# Altium schematic sheet DBL TLC5940 driver for High load.SchDoc: DBL TLC5940 driver for High load
size A4; Revision: 0; SheetNumber: 1; SheetTotal: 2; Version: 1.0; Variant: Variant; Modification: Mod; Project: Light Control; PageSetup: Record=PageOptions|CenterHorizontal=True|CenterVertical=True|PrintScale=0.97|XCorrection=1.00|YCorrection=1.00|PrintKind=1|BorderSize=5000000|LeftOffset=0|BottomOffset=0|Orientation=2|PaperLength=2970|PaperWidth=2100|Scale=100|PaperSource=7|PrintQuality=-4|MediaType=1|DitherType=10|PaperKind=A4|PrintScaleMode=1
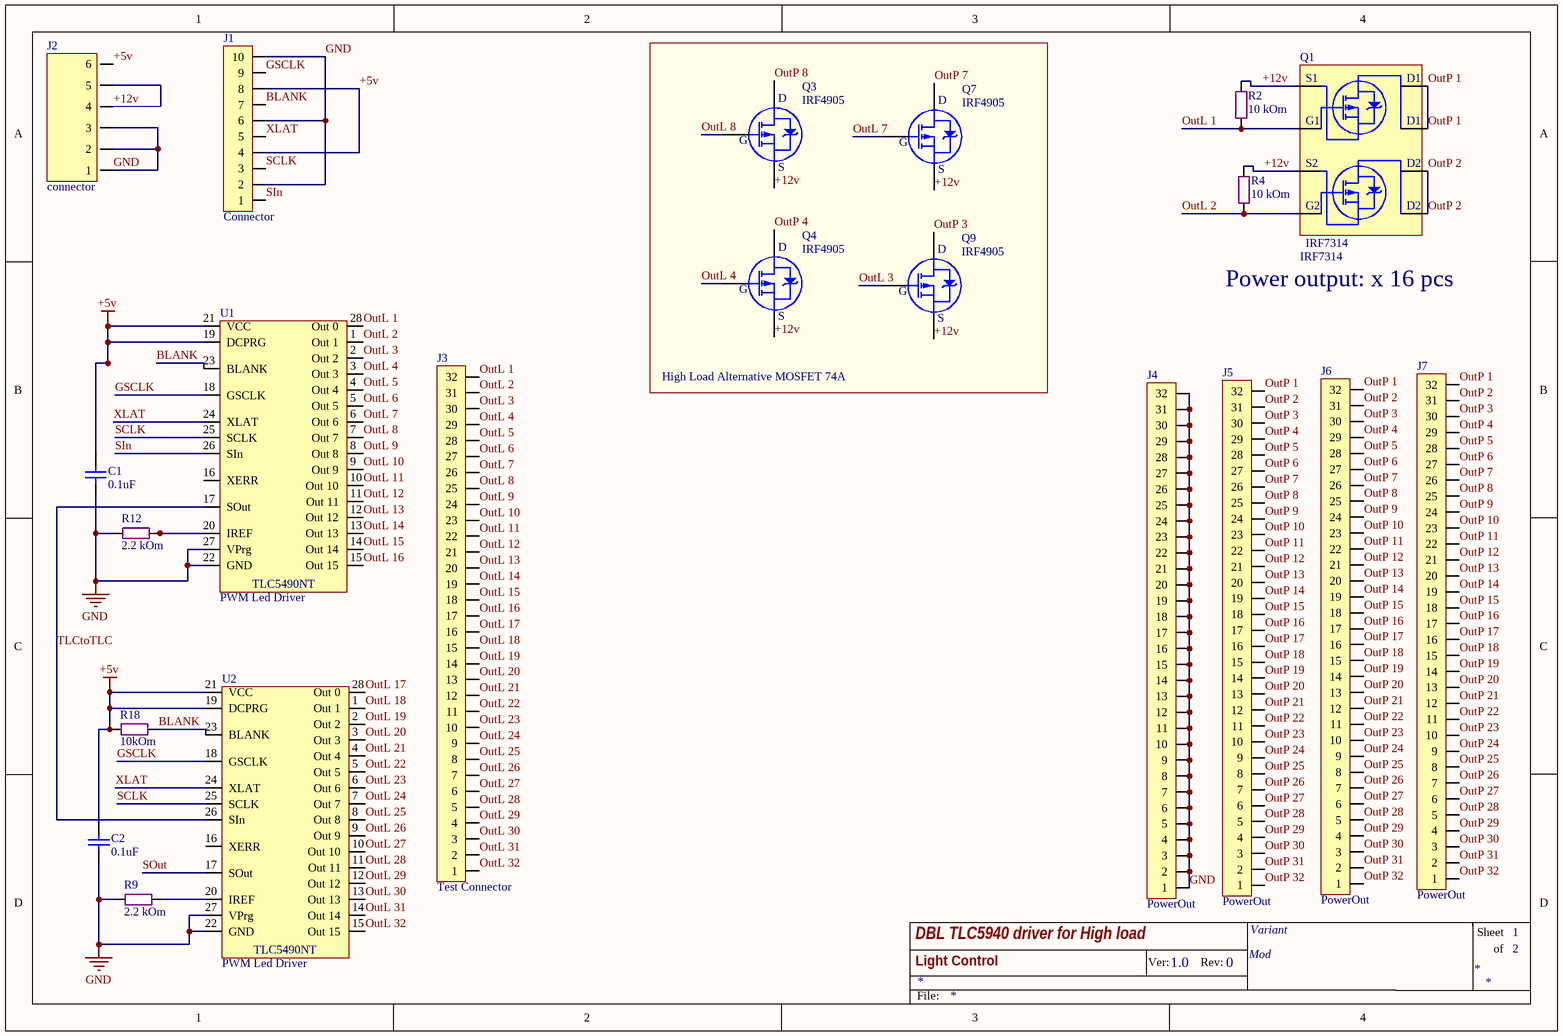
[diagram p0: DBL TLC5940 driver for High load.SchDoc]

## Parts
C1  0.1uF  [SMD 0805 (2012)]
C2  0.1uF  [SMD 0805 (2012)]
J1  Connector  [LINE 2.54 x 10D (2 x 5) - BH]
J2  connector  [Molex Mini-Fit Jr - 6Pin R]
J3  Test Connector  [LINE 2.54 x 32]
J4  PowerOut  [LINE 2.54 x 32]
J5  PowerOut  [LINE 2.54 x 32]
J6  PowerOut  [LINE 2.54 x 32]
J7  PowerOut  [LINE 2.54 x 32]
Q1  IRF7314  [SO8]
Q3  IRF4905  [TO220-2]
Q4  IRF4905  [TO220-2]
Q7  IRF4905  [TO220-2]
Q9  IRF4905  [TO220-2]
R2  10 kOm  [SMD 0805 (2012)]
R4  10 kOm  [SMD 0805 (2012)]
R9  2.2 kOm  [SMD 0805 (2012)]
R12  2.2 kOm  [SMD 0805 (2012)]
R18  10kOm  [SMD 0805 (2012)]
U1  PWM Led Driver  [DIP-28 (OVAL)]
U2  PWM Led Driver  [DIP-28 (OVAL)]

## Blocks framed on the sheet
High Load Alternative MOSFET 74A: Q3 Q4 Q7 Q9

## Nets
+5v: C1.1 C2.1 J1.4 J1.8 J2.6 R18.1 U1.19(DCPRG) U1.21(VCC) U2.19(DCPRG) U2.21(VCC)
GND: C1.2 C2.2 J1.2 J1.6 J1.10 J2.1 J2.2 J2.3 J4.1 J4.2 J4.3 J4.4 J4.5 J4.6 J4.7 J4.8 J4.9 J4.10 J4.11 J4.12 J4.13 J4.14 J4.15 J4.16 J4.17 J4.18 J4.19 J4.20 J4.21 J4.22 J4.23 J4.24 J4.25 J4.26 J4.27 J4.28 J4.29 J4.30 J4.31 J4.32 R9.2 R12.2 U1.22(GND) U1.27(VPrg) U2.22(GND) U2.27(VPrg)
+12v: J2.4 J2.5 Q1.1(S) Q1.3(S) Q3.3(S) Q4.3(S) Q7.3(S) Q9.3(S) R2.2 R4.2
BLANK: J1.7 R18.2 U1.23(BLANK) U2.23(BLANK)
GSCLK: J1.9 U1.18(GSCLK) U2.18(GSCLK)
OutL 1: J3.32 Q1.2(G) R2.1 U1.28(Out_0)
OutL 2: J3.31 Q1.4(G) R4.1 U1.1(Out_1)
OutL 3: J3.30 Q9.1(G) U1.2(Out_2)
OutL 4: J3.29 Q4.1(G) U1.3(Out_3)
OutL 5: J3.28 U1.4(Out_4)
OutL 6: J3.27 U1.5(Out_5)
OutL 7: J3.26 Q7.1(G) U1.6(Out_6)
OutL 8: J3.25 Q3.1(G) U1.7(Out_7)
OutL 9: J3.24 U1.8(Out_8)
OutL 10: J3.23 U1.9(Out_9)
OutL 11: J3.22 U1.10(Out_10)
OutL 12: J3.21 U1.11(Out_11)
OutL 13: J3.20 U1.12(Out_12)
OutL 14: J3.19 U1.13(Out_13)
OutL 15: J3.18 U1.14(Out_14)
OutL 16: J3.17 U1.15(Out_15)
OutL 17: J3.16 U2.28(Out_0)
OutL 18: J3.15 U2.1(Out_1)
OutL 19: J3.14 U2.2(Out_2)
OutL 20: J3.13 U2.3(Out_3)
OutL 21: J3.12 U2.4(Out_4)
OutL 22: J3.11 U2.5(Out_5)
OutL 23: J3.10 U2.6(Out_6)
OutL 24: J3.9 U2.7(Out_7)
OutL 25: J3.8 U2.8(Out_8)
OutL 26: J3.7 U2.9(Out_9)
OutL 27: J3.6 U2.10(Out_10)
OutL 28: J3.5 U2.11(Out_11)
OutL 29: J3.4 U2.12(Out_12)
OutL 30: J3.3 U2.13(Out_13)
OutL 31: J3.2 U2.14(Out_14)
OutL 32: J3.1 U2.15(Out_15)
OutP 1: J5.32 J6.32 J7.32 Q1.7(D) Q1.8(D)
OutP 2: J5.31 J6.31 J7.31 Q1.5(D) Q1.6(D)
OutP 3: J5.30 J6.30 J7.30 Q9.2(D)
OutP 4: J5.29 J6.29 J7.29 Q4.2(D)
OutP 5: J5.28 J6.28 J7.28
OutP 6: J5.27 J6.27 J7.27
OutP 7: J5.26 J6.26 J7.26 Q7.2(D)
OutP 8: J5.25 J6.25 J7.25 Q3.2(D)
OutP 9: J5.24 J6.24 J7.24
OutP 10: J5.23 J6.23 J7.23
OutP 11: J5.22 J6.22 J7.22
OutP 12: J5.21 J6.21 J7.21
OutP 13: J5.20 J6.20 J7.20
OutP 14: J5.19 J6.19 J7.19
OutP 15: J5.18 J6.18 J7.18
OutP 16: J5.17 J6.17 J7.17
OutP 17: J5.16 J6.16 J7.16
OutP 18: J5.15 J6.15 J7.15
OutP 19: J5.14 J6.14 J7.14
OutP 20: J5.13 J6.13 J7.13
OutP 21: J5.12 J6.12 J7.12
OutP 22: J5.11 J6.11 J7.11
OutP 23: J5.10 J6.10 J7.10
OutP 24: J5.9 J6.9 J7.9
OutP 25: J5.8 J6.8 J7.8
OutP 26: J5.7 J6.7 J7.7
OutP 27: J5.6 J6.6 J7.6
OutP 28: J5.5 J6.5 J7.5
OutP 29: J5.4 J6.4 J7.4
OutP 30: J5.3 J6.3 J7.3
OutP 31: J5.2 J6.2 J7.2
OutP 32: J5.1 J6.1 J7.1
SCLK: J1.3 U1.25(SCLK) U2.25(SCLK)
SIn: J1.1 U1.26(SIn)
SOut: U2.17(SOut)
TLCtoTLC: U1.17(SOut) U2.26(SIn)
XLAT: J1.5 U1.24(XLAT) U2.24(XLAT)
NetR9_1: R9.1 U2.20(IREF)
NetR12_1: R12.1 U1.20(IREF)

Not connected (* = marked no-connect by the designer): U1 16(XERR); U2 16(XERR)

## Notes on the sheet
- Power output: x 16 pcs
- Ver:
- Rev:
- Sheet
- of
- File:
- (in symbol IRF7314) S1; D1; G1; S2; D2; G2
- (in symbol TLC5940) TLC5490NT

## Library data of the parts
C1 C2 = Cap SMD 0402-1812: Capacitor
J1 = PLD-10 (2 x 5): Vert, Dbl line, Male
J2 = Molex Mini-Fit Jr - 6 pin: Right, Dbl line, Female
J3-J7 = PLS-32: Vert, Sgl line, Male
Q1 = IRF7314: Dual P-Ch  20V - 0.058Ω - 5.3A; Monufacturer: IOR; RDS Сопротивление Сток-Исток: 0.058 Om; I d - Drain current (continuous) at TC = 100°C: 4.3 A; VGS Порог Открытия: -0.7 V; VGS Макс напр на гейте: +-12 V; C ISS Входная емкость: 780 pF; C OSS Выходная емкость: 470 pF; V DSS (v): 20V; I d - Drain current (continuous) at TC = 25°C: 5.3 A; Name: IRF7314; Datasheet: http://tec.org.ru/_bd/2/277_IRF7314-IR.pdf; URL: http://tec.org.ru/board/49-1-0-277
Q3 Q4 Q7 Q9 = IRF4905: P-Channel 55V - 0.02Ω - 74A; Monufacturer: IOR; RDS Сопротивление Сток-Исток: 0.02 Om; I d - Drain current (continuous) at TC = 100°C: 55 A; VGS Порог Открытия: -2....-4 V; VGS Макс напр на гейте: +-20 V; C ISS Входная емкость: 3400 pF; C OSS Выходная емкость: 1400 pF; V DSS (v): 55V; I d - Drain current (continuous) at TC = 25°C: 74 A; Name: IRF4905; Datasheet: http://tec.org.ru/_bd/32/3287_IRF4905.pdf; URL: http://tec.org.ru/board/irf4905/49-1-0-3287
R2 R4 R9 R12 R18 = Res All Types
U1 U2 = TLC5940: 16-Channel LED Driver With DOT Correction and Grayscale PWM Control; DataSheet: http://www.ti.com/lit/ds/symlink/tlc5940.pdf